# Altium schematic sheet LoRa_stm32.SchDoc
size A3; Author: zhuhb; CompanyName: njupt
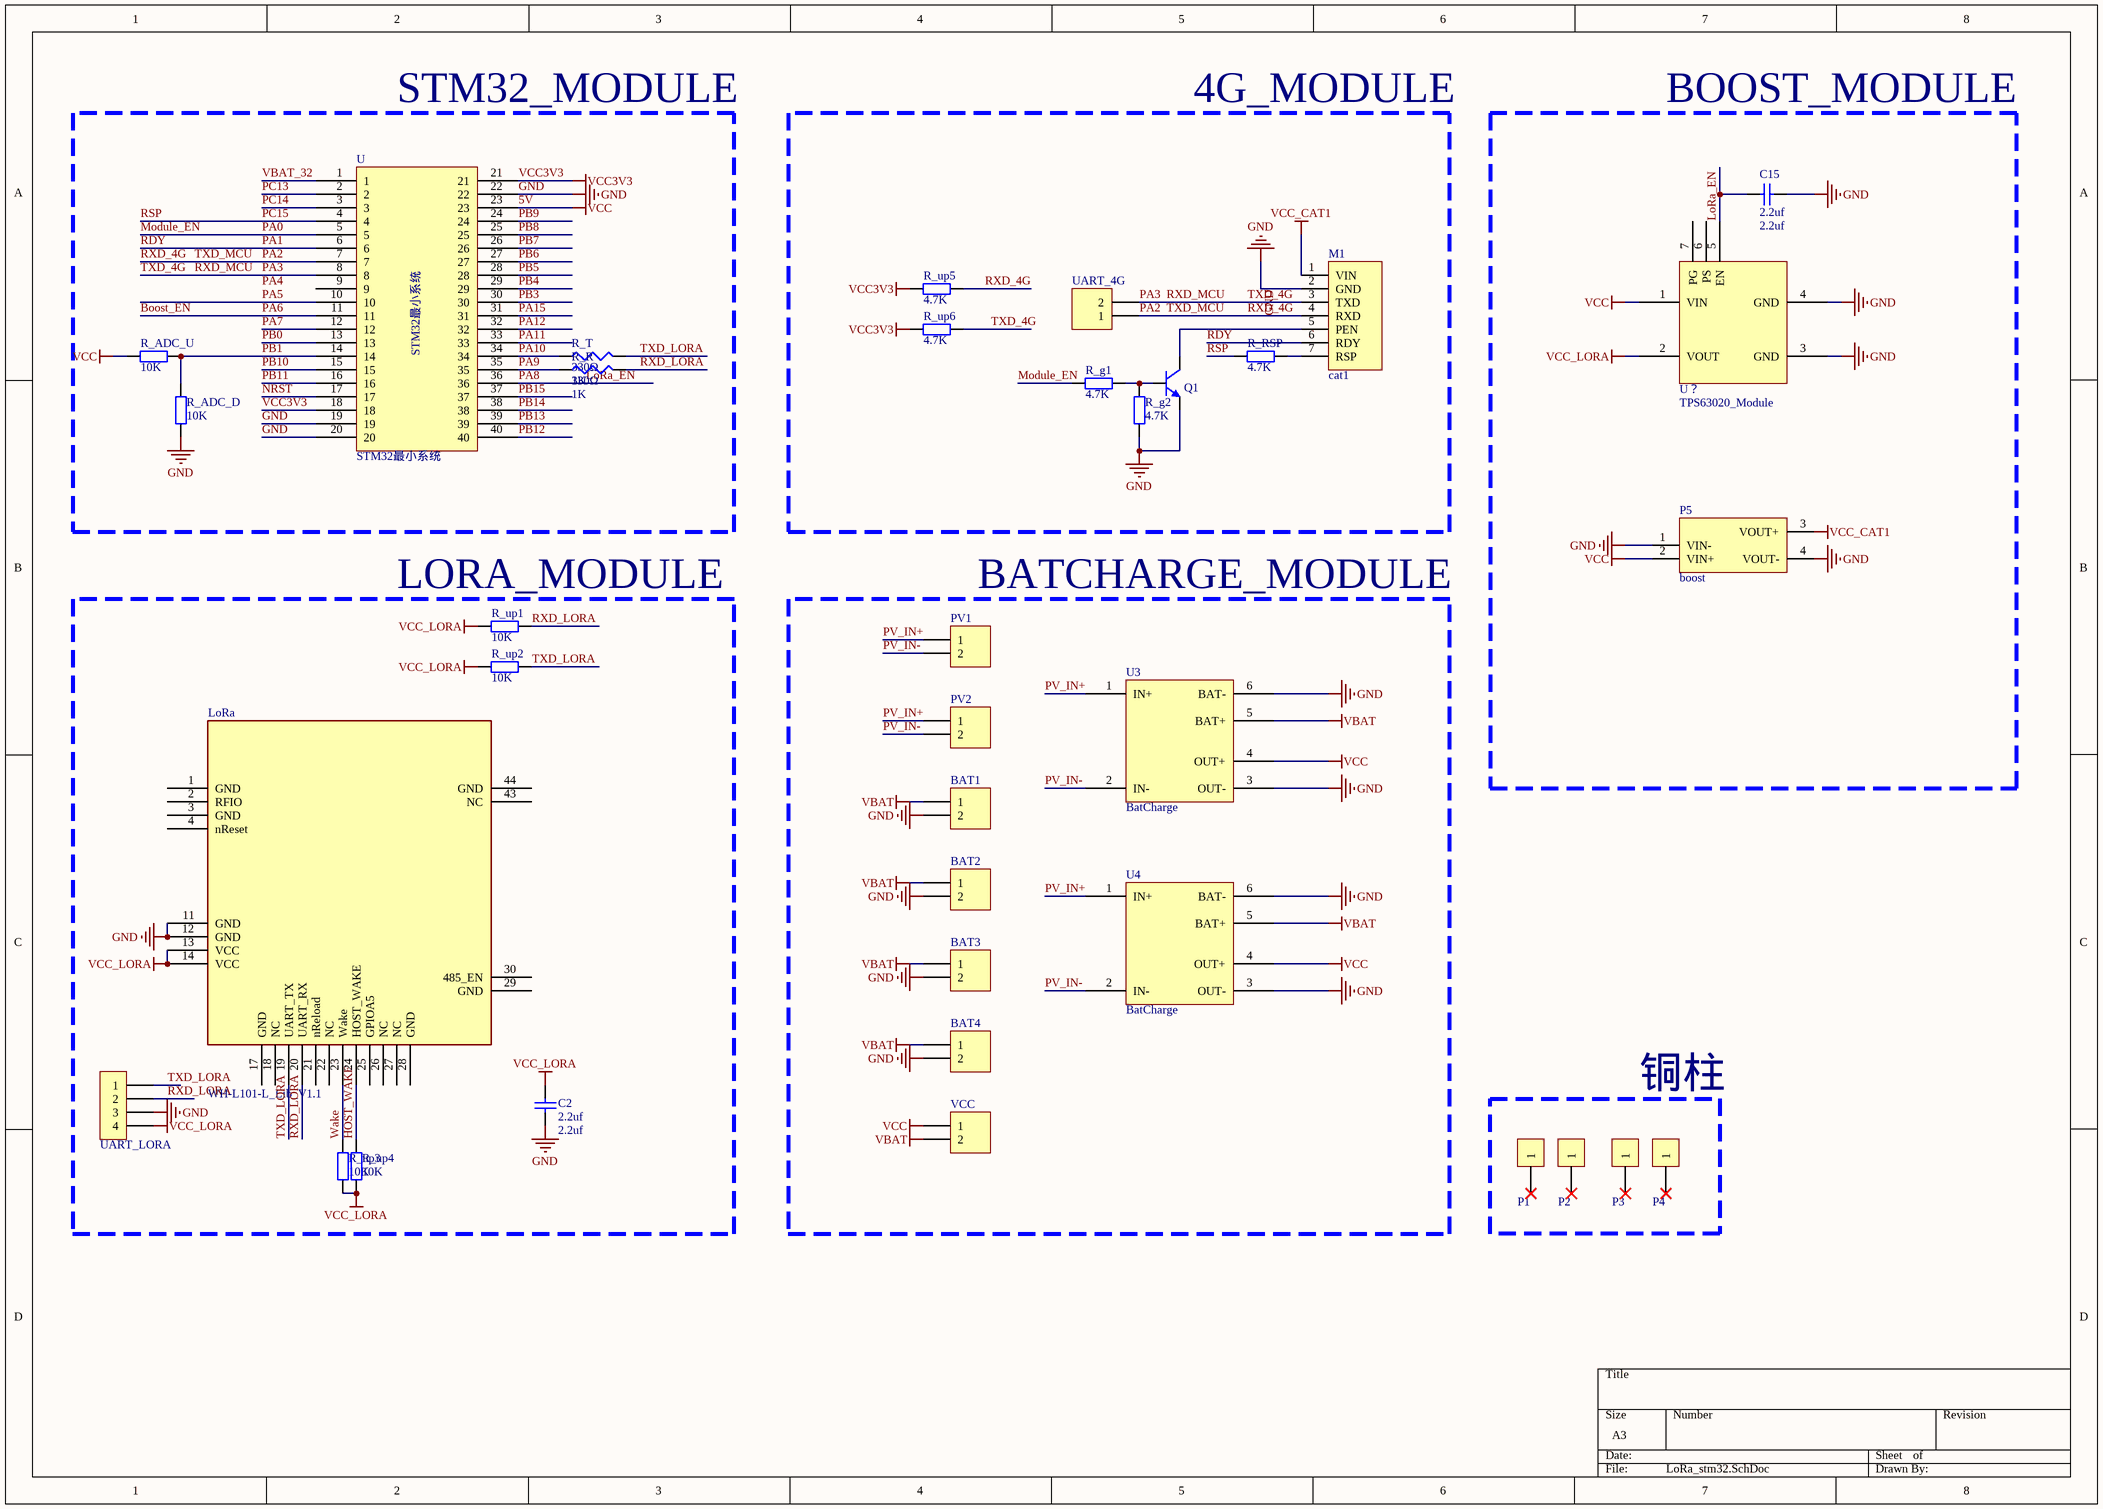
[diagram p0: LoRa_stm32.SchDoc]

## Parts
BAT1  UART_4G  [XH-2P]  (value not drawn)
BAT2  UART_4G  [XH-2P]  (value not drawn)
BAT3  UART_4G  [XH-2P]  (value not drawn)
BAT4  UART_4G  [XH-2P]  (value not drawn)
C2  2.2uf  [0603-C]
C15  2.2uf  [0603-C]
LoRa  WH-L101-L_Lib_V1.1  [SMD-44_18.22X26.65X1.27P]
M1  cat1  [MCore724]
P1  铜柱孔  [铜柱孔]  (value not drawn)
P2  铜柱孔  [铜柱孔]  (value not drawn)
P3  铜柱孔  [铜柱孔]  (value not drawn)
P4  铜柱孔  [铜柱孔]  (value not drawn)
P5  boost  [锂电池升压]
PV1  UART_4G  [XH-2P]  (value not drawn)
PV2  UART_4G  [XH-2P]  (value not drawn)
Q1  三极管(NPN)  [TO-92]  (value not drawn)
R_ADC_D  10K  [0603-R]
R_ADC_U  10K  [0603-R]
R_g1  value 4.7K  [0603-R]  (hidden comment: 10K)
R_g2  value 4.7K  [0603-R]  (hidden comment: 10K)
R_R  330Ω  value 1K  [J1-0603]
R_RSP  value 4.7K  [0603-R]  (hidden comment: 10K)
R_T  330Ω  value 1K  [J1-0603]
R_up1  10K  [0603-R]
R_up2  10K  [0603-R]
R_up3  10K  [0603-R]
R_up4  10K  [0603-R]
R_up5  value 4.7K  [0603-R]  (hidden comment: 10K)
R_up6  value 4.7K  [0603-R]  (hidden comment: 10K)
U  STM32最小系统  [STM32最小系统]
U3  BatCharge  [Bat_Charge]
U4  BatCharge  [Bat_Charge]
UART_4G  UART_4G  [HDR1X2]  (value not drawn)
UART_LORA  XH接线座-4P  [HDR1X4]  (value not drawn)
U？  TPS63020_Module  [TP63020_MODULE]
VCC  UART_4G  [Header1X2]  (value not drawn)

## Blocks framed on the sheet
STM32_MODULE: R_ADC_D R_ADC_U R_R R_T U
4G_MODULE: M1 Q1 R_g1 R_g2 R_RSP R_up5 R_up6 UART_4G
BOOST_MODULE: C15 P5 U？
LORA_MODULE: C2 LoRa R_up1-R_up4 UART_LORA
BATCHARGE_MODULE: BAT1-BAT4 PV1 PV2 U3 U4 VCC
铜柱: P1-P4

## Nets
5V: P5.2(VIN+) R_ADC_U.2 U.23 U3.4(OUT+) U4.4(OUT+) U？.1(VIN) VCC.1  [also labelled VCC]
GND: BAT1.2 BAT2.2 BAT3.2 BAT4.2 C2.2 C15.2 LoRa.11(GND) LoRa.12(GND) M1.2(GND) P5.1(VIN-) P5.4(VOUT-) Q1.1(E) R_ADC_D.2 R_g2.2 U.19 U.20 U.22 U3.3(OUT-) U3.6(BAT-) U4.3(OUT-) U4.6(BAT-) UART_LORA.3 U？.3(GND) U？.4(GND)
VBAT: BAT1.1 BAT2.1 BAT3.1 BAT4.1 U3.5(BAT+) U4.5(BAT+) VCC.2
VCC3V3: R_up5.2 R_up6.2 U.18 U.21
VCC_CAT1: M1.1(VIN) P5.3(VOUT+)
VCC_LORA: C2.1 LoRa.13(VCC) LoRa.14(VCC) R_up1.2 R_up2.2 R_up3.2 R_up4.2 UART_LORA.4 U？.2(VOUT)
Boost_EN: U.11  [also labelled PA6]
HOST_WAKE: LoRa.24(HOST_WAKE) R_up4.1
LoRa_EN: C15.1 U.36 U？.5(EN)  [also labelled PA8]
Module_EN: R_g1.2 U.5  [also labelled PA0]
NRST: U.17
PA1: M1.6(RDY) U.6  [also labelled RDY]
PA2: M1.4(RXD) R_up5.1 U.7 UART_4G.1  [also labelled RXD_4G, TXD_MCU]
PA3: M1.3(TXD) R_up6.1 U.8 UART_4G.2  [also labelled RXD_MCU, TXD_4G]
PA5: U.10
PA7: U.12
PA9: R_R.1 U.35
PA10: R_T.1 U.34
PA11: U.33
PA12: U.32
PA15: U.31
PB0: U.13
PB1: R_ADC_D.1 R_ADC_U.1 U.14
PB3: U.30
PB4: U.29
PB5: U.28
PB6: U.27
PB7: U.26
PB8: U.25
PB9: U.24
PB10: U.15
PB11: U.16
PB12: U.40
PB13: U.39
PB14: U.38
PB15: U.37
PC13: U.2
PC14: U.3
PC15: R_RSP.2 U.4  [also labelled RSP]
PV_IN+: PV1.1 PV2.1 U3.1(IN+) U4.1(IN+)
PV_IN-: PV1.2 PV2.2 U3.2(IN-) U4.2(IN-)
RXD_LORA: LoRa.20(UART_RX) R_R.2 R_up1.1 UART_LORA.2
TXD_LORA: LoRa.19(UART_TX) R_T.2 R_up2.1 UART_LORA.1
VBAT_32: U.1
Wake: LoRa.23(Wake) R_up3.1
NetM1_5: M1.5(PEN) Q1.3(C)
NetM1_7: M1.7(RSP) R_RSP.1
NetQ1_2: Q1.2(B) R_g1.1 R_g2.1

Not connected (* = marked no-connect by the designer): LoRa 1(GND) 2(RFIO) 3(GND) 4(nReset) 17(GND) 18(NC) 21(nReload) 22(NC) 25(GPIOA5) 26(NC) 27(NC) 28(GND) 29(GND) 30(485_EN) 43(NC) 44(GND); P1 1*; P2 1*; P3 1*; P4 1*; U 9; U？ 6(PS) 7(PG)

## Notes on the sheet
- Labels drawn without touching a wire or pin: PA4

## Library data of the parts
BAT1-BAT4 PV1 PV2 UART_4G VCC = Header 2: Header, 2-Pin; LatestRevisionDate: 17-Jul-2002; LatestRevisionNote: Re-released for DXP Platform.; Publisher: Altium Limited
C2 C15 = Cap: Capacitor; Published: 8-Jun-2000; LatestRevisionDate: 17-Jul-2002; LatestRevisionNote: Re-released for DXP Platform.; PackageReference: RAD-0.3; Publisher: Altium Limited; PackageDescription: Radial Cap, Thru-Hole; 2 Leads; 0.3 in Pin Spacing; Value: 2.2uf
M1 = MCore_A724UG: 4G透传模块
P5 = Boost12V: 锂电池升压至5/8/9/12V
R_ADC_D R_ADC_U R_g1 R_g2 R_RSP R_up1-R_up6 = Res1: 贴片电阻; Published: 8-Jun-2000; LatestRevisionDate: 17-Jul-2002; LatestRevisionNote: Re-released for DXP Platform.; PackageReference: AXIAL-0.4; Publisher: Altium Limited
  R_ADC_D R_ADC_U R_up1-R_up4: Value: 10K
R_R R_T = Res3: Resistor; Published: 8-Jun-2000; LatestRevisionDate: 29-May-2009; LatestRevisionNote: IPC-7351 Footprint Added.; PackageReference: J1-0603; Publisher: Altium Limited; PackageDescription: Chip Resistor
U3 U4 = BatCharge: 电池充电模块
U？ = TPS63020_Module: 升压模块模块